# Altium schematic sheet o,power.SchDoc
size A4; SheetNumber: 1; SheetTotal: 2
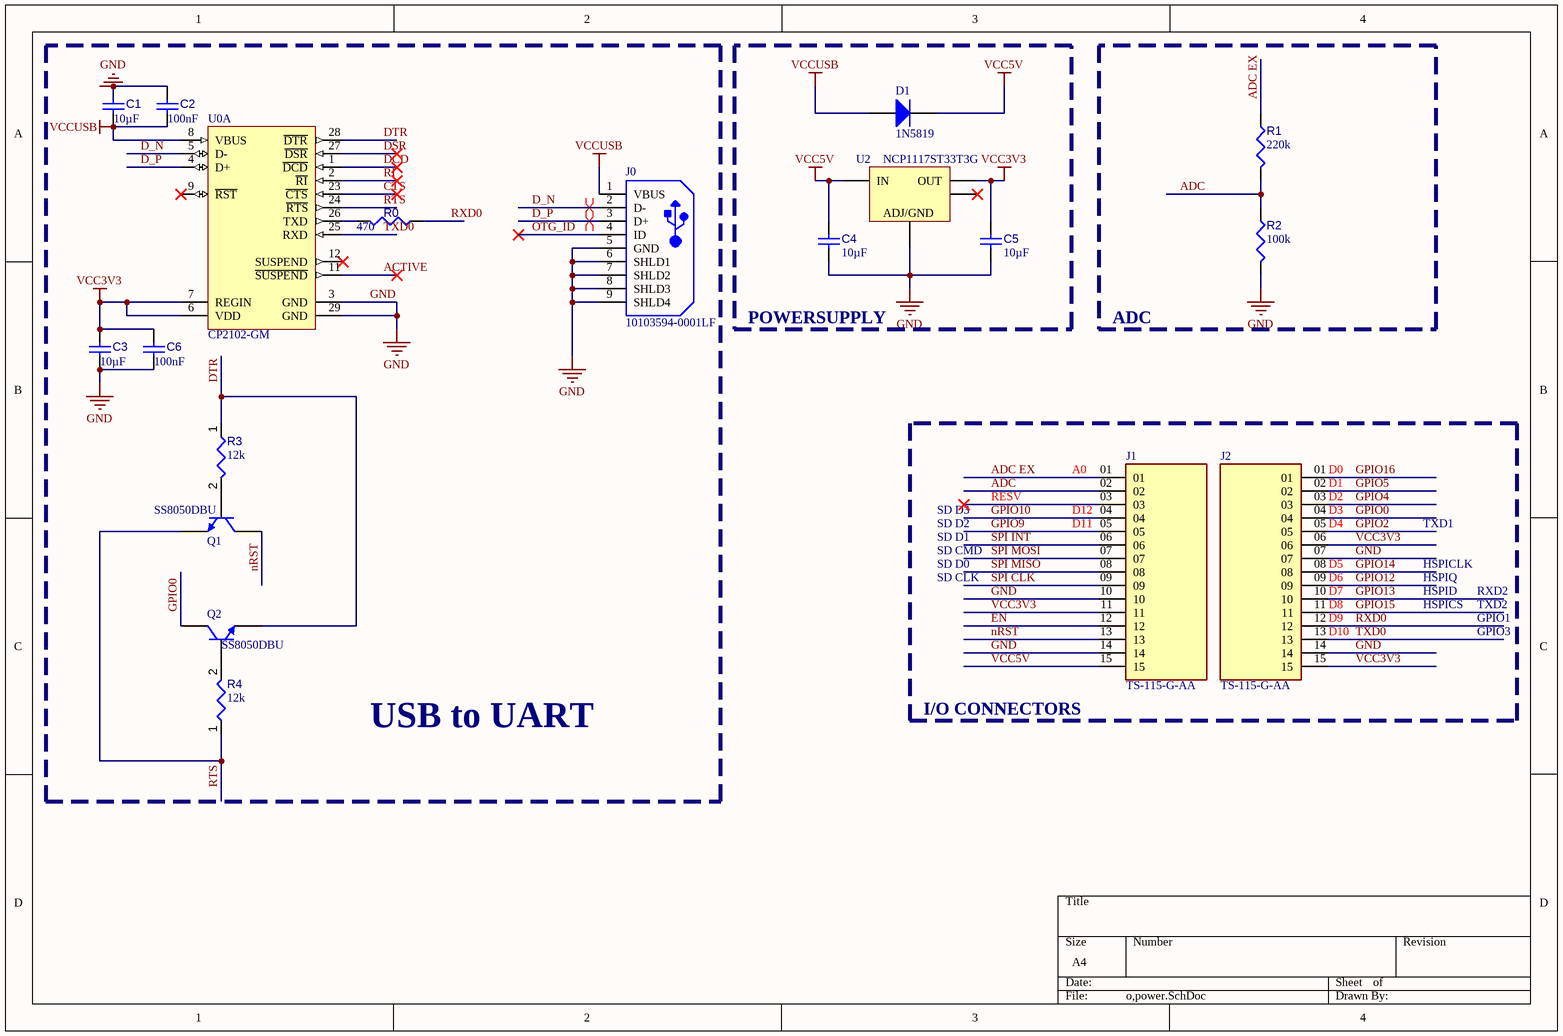
[diagram p0: o,power.SchDoc]

## Parts
C1  value 10µF  [CAPC2013X135X45NL10T25]  (hidden comment: Capacitor 10 uF +/- 10% 16 V 0805)
C2  value 100nF  [CAPC2013X95X50LL10T25]  (hidden comment: Capacitor 100 nF +/-10% 50 V 0805)
C3  value 10µF  [CAPC2013X135X45NL10T25]  (hidden comment: Capacitor 10 uF +/- 10% 16 V 0805)
C4  value 10µF  [CAPC0805(2012)145_L]  (hidden comment: Capacitor 10µF +/-20% 25V 0805)
C5  value 10µF  [CAPC2013X135X45NL10T25]  (hidden comment: Capacitor 10 uF +/- 10% 16 V 0805)
C6  value 100nF  [CAPC2013X95X50LL10T25]  (hidden comment: Capacitor 100 nF +/-10% 50 V 0805)
D1  1N5819  [ONSC-AXIAL_LEAD-2-59-10_P]
J0  10103594-0001LF  [FCI-10103594-0001LF_V]
J1  TS-115-G-AA  [SAMTEC_TS-115-G-AA]
J2  TS-115-G-AA  [SAMTEC_TS-115-G-AA]
Q1  SS8050DBU  [QFN50P400X400X80_HS-15N]
Q2  SS8050DBU  [QFN50P400X400X80_HS-15N]
R0  value 470  [RESC0805(2012)_L]  (hidden comment: Resistor 470R +/-5% 0805 125 mW)
R1  value 220k  [RESC1005X06N]  (hidden comment: MCRE000196)
R2  value 100k  [RESC0402(1005)_L]  (hidden comment: Resistor 100K +/-1 % 0402 63 mW)
R3  value 12k  [RESC0402(1005)_L]  (hidden comment: Resistor 12K  +/-1 % 0402 63 mW)
R4  value 12k  [RESC0402(1005)_L]  (hidden comment: Resistor 12K  +/-1 % 0402 63 mW)
U0  CP2102-GM  [BGA81C100P9X9_1100X1100X350]  (part A of 2)
U2  NCP1117ST33T3G  [ONSC-SOT-223-4-318H-01_A_V]

## Blocks framed on the sheet
USB to UART: C1-C3 C6 J0 Q1 Q2 R0 R3 R4 U0
POWERSUPPLY: C4 C5 D1 U2
ADC: R1 R2
I/O CONNECTORS: J1 J2

## Nets
GND: C1.1 C2.1 C3.2 C4.2 C5.2 C6.2 J0.5(GND) J0.6(SHLD1) J0.7(SHLD2) J0.8(SHLD3) J0.9(SHLD4) J1.10 J1.14 J2.07 J2.14 R2.2 U0.3(GND) U0.29(GND) U2.1(ADJ/GND)
VCC3V3: C3.1 C5.1 C6.1 J1.11 J2.06 J2.15 U0.6(VDD) U0.7(REGIN) U2.2(OUT)
VCC5V: C4.1 D1.2(K) J1.15 U2.3(IN)
VCCUSB: C1.2 C2.2 D1.1(A) J0.1(VBUS) U0.8(VBUS)
ACTIVE: U0.11(~{SUSPEND})
ADC: J1.02 R1.2 R2.1
ADC EX: J1.01 R1.1
CTS: U0.23(~{CTS})
D_N: J0.2(D-) U0.5(D-)
D_P: J0.3(D+) U0.4(D+)
DCD: U0.1(~{DCD})
DSR: U0.27(~{DSR})
DTR: Q2.1(E) R3.1 U0.28(~{DTR})
EN: J1.12
GPIO0: J2.04 Q2.3(C)
GPIO2: J2.05
GPIO4: J2.03
GPIO5: J2.02
GPIO9: J1.05
GPIO10: J1.04
GPIO12: J2.09
GPIO13: J2.10
GPIO14: J2.08
GPIO15: J2.11
GPIO16: J2.01
nRST: J1.13 Q1.3(C)
OTG_ID: J0.4(ID)
RESV: J1.03
RI: U0.2(~{RI})
RTS: Q1.1(E) R4.1 U0.24(~{RTS})
RXD0: J2.12 R0.1
SPI CLK: J1.09
SPI INT: J1.06
SPI MISO: J1.08
SPI MOSI: J1.07
TXD0: J2.13 U0.25(RXD)
NetQ1_2: Q1.2(B) R3.2
NetQ2_2: Q2.2(B) R4.2
NetR0_2: R0.2 U0.26(TXD)

Not connected (* = marked no-connect by the designer): U0 9(~{RST})* 12(SUSPEND)*; U2 4(TAB)*

## Layout directives
differential pair: D_N, D_P

## Notes on the sheet
- SD D3
- (near J1) A0
- (near J1) D12
- (near J2) D0
- (near J2) D1
- (near J2) D2
- (near J2) D3
- SD D1
- SD CMD
- SD D0
- SD CLK
- SD D2
- (near J1) D11
- (near J2) D4
- (near J2) D5
- (near J2) D6
- TXD1
- HSPICLK
- HSPIQ
- (near J2) D7
- (near J2) D8
- (near J2) D9
- (near J2) D10
- HSPID
- HSPICS
- RXD2
- TXD2
- GPIO1
- GPIO3

## Library data of the parts
C1 C3 C5 = CMP-001-00015-6: Chip Capacitor, 10 uF, +/- 10%, 16 V, 0805 (2012 Metric); Voltage Rating: 16V; Capacitor Type: Ceramic; RoHS Compliant: True; Max Operating Temperature: 85°C; Min Operating Temperature: -55°C; Mounting Technology: SM; Tolerance: 10%; Case/Package: 0805; Pins: 2
C2 C6 = CMP-001-00018-6: Chip Capacitor, 100 nF, +/- 10%, 50 V, 0805 (2012 Metric); Capacitor Type: Ceramic; Voltage Rating: 50V; Pins: 2; Max Operating Temperature: 125°C; Min Operating Temperature: -55°C; Mounting Technology: SM; Case/Package: 0805; RoHS Compliant: True; Tolerance: 10%
C4 = CMP-001-00079-4: Chip Capacitor, 10µF +/-20%, 25V, 0805, Thickness 1.45 mm; Tolerance: 10%; Max Operating Temperature: 85°C; Case/Package: 0805; Voltage Rating: 25V; Min Operating Temperature: -55°C; Mounting Technology: SMT; Pins: 2
D1 = CMP-004-00009-2: Low Drop Power Schottky Rectifier, 40 V, 1 A, 2-Pin DO-41, RoHS; Manufacturer: ON Semiconductor; Max Surge Current: 25A; Forward Current: 1A; Package Version: Rev. U, 02/2005; Peak Reverse Current: 1mA; Max Operating Temperature: 125°C; Case/Package: DO; Package URL: http://www.onsemi.cn/pub_link/Collateral/59-10.PDF; Packaging: Bulk; Manufacturer URL: http://www.onsemi.com/; Min Operating Temperature: -65°C; Package Description: 2-Pin, Axial Lead, Diameter 2.35 mm; Mounting Technology: TH; Datasheet URL: http://www.onsemi.cn/pub_link/Collateral/1N5817-D.PDF; Datasheet Version: Rev. 10, 07/2006; Package Reference: AXIAL_LEAD-2-59-10; Pins: 2; RoHS Compliant: True
J0 = CMP-002-00038-3: Micro USB 2.0 B Receptacle, 5 Position, Height 3.24 mm, -55 to 85 degC, RoHS, Tape and Reel; Manufacturer: FCI Electronics; Gender: Female; Voltage Rating: 100V; Current Rating: 1.8A; Max Operating Temperature: 85°C; Case/Package: FCI-10103594-0001LF; Datasheet URL: http://portal.fciconnect.com/Comergent//fci/drawing/10103594.pdf; Manufacturer URL: http://portal.fciconnect.com/; Datasheet Version: Rev. A, 06/2010; Mounting Technology: SM; Package Description: 5-Pin Surface Mount Device, Body 8.04 x 5.62 mm; Package Quantity: 1500; Packaging: TapeandReel; Connector Type: USB; Contact Material: Copper; Lead Pitch: 0.65mm; Package Reference: FCI-10103594-0001LF; Min Operating Temperature: -55°C; RoHS Compliant: True; Pins: 5; Contact Plating: Gold
J1 J2 = CMP-007-000000-1: MF: Samtec; Source: TS-115-G-AA.SchLib; Pin Count: 15; Component Type: Standard; MP: TS-115-G-AA; Availability: Unavailable; Value: *; Design Item ID: TS-115-G-AA; Package: None; Price: None
Q1 Q2 = CMP-013-00034-1: Small Signal Bipolar Transistor, 1.5A I(C), 25V V(BR)CEO, 1-Element, NPN, Silicon, TO-92; Frequency: 190MHz; RoHS Compliant: Yes; Pins: 3; Max Operating Temperature: 150°C
R0 = CMP-009-00122-3: Chip Resistor, 470 Ohms, +/-5%, 125 mW, -55 to 155 degC, 0805; Tolerance: 5%; Power: 125mW; Max Operating Temperature: 155°C; Case/Package: 0805; Pins: 2; Min Operating Temperature: -55°C
R1 = CMP-009-00177-1: Fixed Resistor, Metal Glaze/thick Film, 0.05W, 220000ohm, 25V, 1% +/-Tol, -200,200ppm/Cel, 0201; Power: 50mW; Case/Package: 0201; RoHS Compliant: Yes; Max Operating Temperature: 125°C; Tolerance: 1%; Pins: 2; Min Operating Temperature: -55°C
R2 = CMP-009-00168-3: Chip Resistor, 100 kOhms, +/-1 %, 63 mW, -55 to 155 degC, 0402; Tolerance: 1%; Power: 63mW; Max Operating Temperature: 155°C; Min Operating Temperature: -55°C; Pins: 2; Case/Package: 0402
R3 R4 = CMP-009-00173-3: Chip Resistor, 12 kOhms, +/-1 %, 63 mW, -55 to 155 degC, 0402; Power: 63mW; Tolerance: 1%; Max Operating Temperature: 155°C; Min Operating Temperature: -55°C; Case/Package: 0402; Pins: 2
U0 = CMP-005-00013-1: USB Bus Controller, CMOS; Max Operating Temperature: 85°C; Min Operating Temperature: -40°C; Case/Package: HVQCCN; RoHS Compliant: Yes; Pins: 28
U2 = CMP-019-00030-3: Low-Dropout Positive Fixed Voltage Regulator, 1 A, 3.3 V Output Voltage, 0 to 125 degC, 4-Pin SOT-223 (318H-01), Pb-Free, Tape and Reel; Manufacturer: ON Semiconductor; Max Supply Voltage: 15V; Min Input Voltage: 3.5V; Max Ouput Current: 1A; Output Voltage: 3.3V; Outputs: 1; Min Supply Voltage: 4.75V; Max Input Voltage: 20V; Dropout Voltage: 1.1V; Package Reference: SOT-223-4-318H-01_A; Package Quantity: 4000; Manufacturer URL: http://www.onsemi.com/; Mounting Technology: SM; Output Current: 1A; Min Operating Temperature: 0°C; Datasheet URL: http://www.onsemi.com/pub_link/Collateral/NCP1117-D.PDF; RoHS Compliant: True; Pins: 3; Case/Package: SOT-223-4; Packaging: TapeandReel; Max Operating Temperature: 125°C; Package Description: 4-Pin Small Outline Transistor, Body 6.5 x 3.5 mm, Pitch 2.3 mm; Nominal Output Voltage: 3.3V; Datasheet Version: Rev. 27, 09/2014